# Altium project bch-stmnode_v0.1.PrjPcb (part 2 of 2)

## Sheet analog_mics.SchDoc
size A4; SheetNumber: 7; SheetTotal: 8
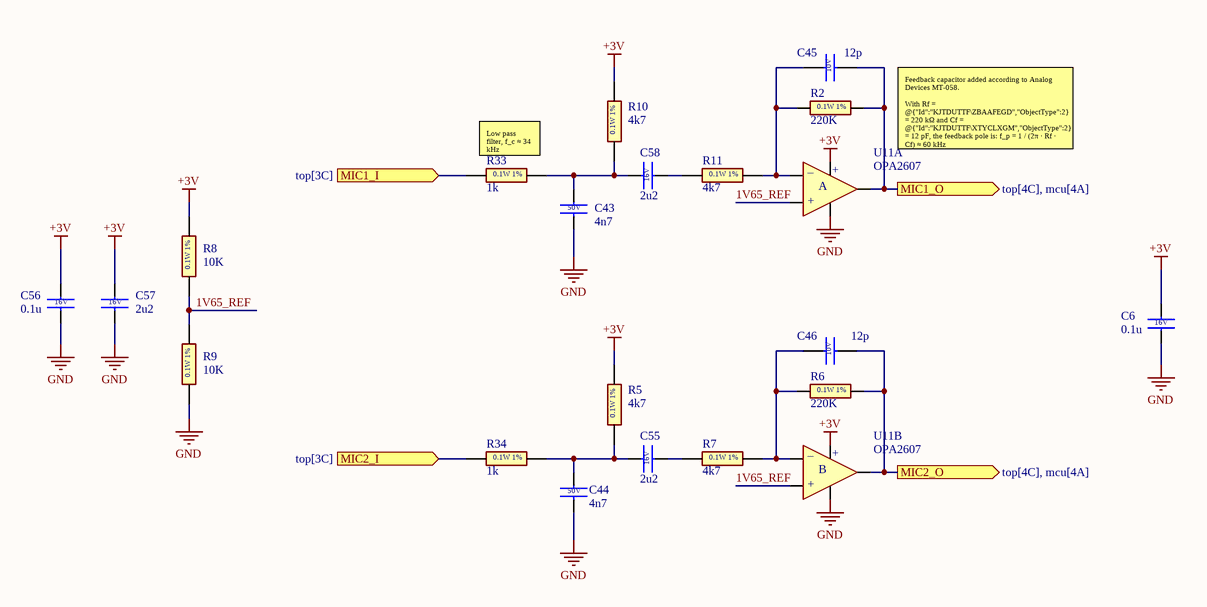
[diagram p6: analog_mics.SchDoc]

### Parts
(Parts that share a designator on the sheet are numbered #1, #2 ... from top to bottom, then left to right.)
C6#2  0.1u  [CAPC1608X95N]
C43  4n7  [C0603]
C44  4n7  [C0603]
C45  12p  [CAPC1608X97N]
C46  12p  [CAPC1608X97N]
C55  2u2  [CAPC1608X90N]
C56  0.1u  [CAPC1608X95N]
C57  2u2  [CAPC1608X90N]
C58  2u2  [CAPC1608X90N]
R2  220K  [RESC1608X55N]
R5  4k7  [RESC1608X50N]
R6  220K  [RESC1608X55N]
R7  4k7  [RESC1608X50N]
R8  10K  [RESC1608X50N]
R9  10K  [RESC1608X50N]
R10  4k7  [RESC1608X50N]
R11  4k7  [RESC1608X50N]
R33#2  1k  [RESC1608X50N]
R34#2  1k  [RESC1608X50N]
U11  OPA2607  [SOIC127P600X175-8N]  (parts A,B of 2)

### Ports
MIC1_I (in, see top[3C]), MIC1_O (out, see top[4C], mcu[4A]), MIC2_I (in, see top[3C]), MIC2_O (out, see top[4C], mcu[4A])

### Nets
+3V: C6#2.1 C56.1 C57.1 R5.2 R8.2 R10.2 U11.8(VS+)
GND: C6#2.2 C43.2 C44.2 C56.2 C57.2 R9.1 U11.4(VS-)
1V65_REF: R8.1 R9.2 U11.3(IN1+) U11.5(IN2+)  [project net 1V65_REF_7]
NetC43_1: C43.1 C58.1 R10.1 R33#2.2
NetC44_1: C44.1 C55.1 R5.1 R34#2.2
NetC45_1: C45.1 R2.1 R11.2 U11.2(IN1-)
NetC45_2: C45.2 R2.2 U11.1(OUT1) ; port MIC1_O
NetC46_1: C46.1 R6.1 R7.2 U11.6(IN2-)
NetC46_2: C46.2 R6.2 U11.7(OUT2) ; port MIC2_O
NetC55_2: C55.2 R7.1
NetC58_2: C58.2 R11.1
NetJ10_3: R33#2.1 ; port MIC1_I
NetJ10_5: R34#2.1 ; port MIC2_I

### Notes on the sheet
- (near R33#2) Low pass filter, f_c ≈ 34 kHz
- Feedback capacitor added according to Analog Devices MT-058.
  With Rf = @{"Id":"KJTDUTTF\ZBAAFEGD","ObjectType":2} = 220 kΩ and Cf = @{"Id":"KJTDUTTF\XTYCLXGM","ObjectType":2} = 12 pF, the feedback pole is: f_p = 1 / (2π · Rf · Cf) ≈ 60 kHz
  This limits high-frequency gain and helps improve stability / RF noise immunity.
- Název výkresu /drawing title/:
- Název souboru /sheet name/:
- Varianta /variant/:
- Organizace /organisation/:
- ČVUT FEL
- Kreslil /drawn by/:
- Datum /date/:
- Podpis /signature/:
- List /sheet/:
- Verze /version/:
- /
- (in symbol ECK+2.2u16V) 16V
- (in symbol ECK+4n750V) 50V
- (in symbol ECK+12p10V) 10V
- (in symbol ECK+100n16V) 16V
- (in symbol ER+1K) 0.1W 1%
- (in symbol ER+4k7) 0.1W 1%
- (in symbol ER+10K) 0.1W 1%
- (in symbol ER+220K) 0.1W 1%
- (in symbol EU+OPA2607IDR, part A) +; –; A
- (in symbol EU+OPA2607IDR, part B) +; –; B

### Library data of the parts
C6#2 C56 = ECK+100n16V: 16V 0.1uF XR7 0603 10%; Manufacturer_Name: KEMET; Manufacturer_Part_Number: C0603C104K4RAC-TU; Datasheet Link: https://connect.kemet.com:7667/gateway/IntelliData-ComponentDocumentation/1.0/download/specsheet/C0603C104K4RACTU; Height: 0.95mm; Mouser Part Number: 80-C0603C104K4RAC; Arrow Part Number: C0603C104K4RAC-TU; Arrow Price/Stock: https://www.arrow.com/en/products/c0603c104k4ractu/kemet-corporation
C43 C44 = ECK+4n750V: 50 VDC, 10 %, X7R; Manufacturer_Name: KEMET; Manufacturer_Part_Number: C0603C472K5RACTU; Datasheet Link: https://content.kemet.com/datasheets/KEM_C1002_X7R_SMD.pdf; Height: 0.87mm; Arrow Part Number: C0603C472K5RACTU; Arrow Price/Stock: https://www.arrow.com/en/products/c0603c472k5ractu/kemet-corporation?region=nac
C45 C46 = ECK+12p10V: Multilayer Ceramic Capacitors MLCC - SMD/SMT 0603 12pF 10volts C0G(N0P) 1%; Manufacturer_Name: Vishay; Manufacturer_Part_Number: VJ0603A120FXQCW1BC; Datasheet Link: https://www.vishay.com/docs/45199/vjcommercialseries.pdf; Height: 0.97mm; Mouser Part Number: 77-VJ0603A120FXQCBC; Mouser Price/Stock: https://www.mouser.com/Search/Refine.aspx?Keyword=77-VJ0603A120FXQCBC; Arrow Part Number: VJ0603A120FXQCW1BC; Arrow Price/Stock: https://www.arrow.com/en/products/vj0603a120fxqcw1bc/vishay
C55 C57 C58 = ECK+2.2u16V: Multilayer Ceramic Capacitors MLCC - SMD/SMT 2.2 uF 16 VDC 10% 0603 X6S; Manufacturer_Name: Murata Electronics; Manufacturer_Part_Number: GRM188C81C225KA12D; Datasheet Link: https://search.murata.co.jp/Ceramy/image/img/A01X/G101/ENG/GRM188C81C225KA12-04A.pdf; Height: 0.9mm; Mouser Part Number: 81-GRM188C81C225KA2D; Mouser Price/Stock: https://www.mouser.co.uk/ProductDetail/Murata-Electronics/GRM188C81C225KA12D?qs=O5cugoO6nwevZQeqg2lgHQ%3D%3D; Arrow Part Number: GRM188C81C225KA12D; Arrow Price/Stock: https://www.arrow.com/en/products/grm188c81c225ka12d/murata-manufacturing?utm_currency=USD&region=nac
R2 R6 = ER+220K: Thick Film Resistors - SMD 1/8 Watt 220Kohms 1%; Manufacturer_Name: Vishay; Manufacturer_Part_Number: CRCW0603220KFKEA; Datasheet Link: https://www.vishay.com/docs/20035/dcrcwe3.pdf; Height: 0.55mm; Mouser Part Number: 71-CRCW0603-220K-E3; Mouser Price/Stock: https://cz.mouser.com/ProductDetail/Vishay/CRCW0603220KFKEA?qs=pVi9qluBdEGy7pbAV1jqkQ%3D%3D
R5 R7 R10 R11 = ER+4k7: Resistor 1%, 0.1W; Manufacturer_Name: Vishay; Manufacturer_Part_Number: CRCW06034K70FKEAHP; Datasheet Link: http://www.farnell.com/datasheets/1885357.pdf; Height: 0.5mm; Mouser Part Number: 71-CRCW06034K70FKEAH; Mouser Price/Stock: https://www.mouser.co.uk/ProductDetail/Vishay-Dale/CRCW06034K70FKEAHP?qs=k2%2FDWSARqgF9tclCHvhGkQ%3D%3D; Arrow Part Number: CRCW06034K70FKEAHP; Arrow Price/Stock: https://www.arrow.com/en/products/crcw06034k70fkeahp/vishay?region=nac
R8 R9 = ER+10K: Resistor 1%, 0.1W; Manufacturer_Name: Vishay; Manufacturer_Part_Number: CRCW060310K0FKEA; Datasheet Link: http://www.vishay.com/docs/20035/dcrcwe3.pdf; Height: 0.5mm; Mouser Part Number: 71-CRCW0603-10K-E3; Mouser Price/Stock: https://www.mouser.co.uk/ProductDetail/Vishay-Dale/CRCW060310K0FKEA?qs=pAO1Z172M84BVnhDjtnsoQ%3D%3D; Arrow Part Number: CRCW060310K0FKEA; Arrow Price/Stock: https://www.arrow.com/en/products/crcw060310k0fkea/vishay?region=europe
R33#2 R34#2 = ER+1K: Resistor 1%, 0.1W; Manufacturer_Name: Vishay; Manufacturer_Part_Number: CRCW06031K00FKEA; Datasheet Link: http://www.vishay.com/docs/20035/dcrcwe3.pdf; Height: 0.5mm; Mouser Part Number: 71-CRCW0603-1.0K-E3; Mouser Price/Stock: https://www.mouser.co.uk/ProductDetail/Vishay-Dale/CRCW06031K00FKEA?qs=CToX950LohJasujQx7GY3g%3D%3D; Arrow Part Number: CRCW06031K00FKEA; Arrow Price/Stock: https://www.arrow.com/en/products/crcw06031k00fkea/vishay?region=europe
U11 = EU+OPA2607IDR: Operational Amplifiers - Op Amps Dual-channel low-po wer precision 50-M; Manufacturer_Name: Texas Instruments; Datasheet Link: https://www.ti.com/lit/ds/symlink/opa2607.pdf; Height: 1.75mm; Manufacturer_Part_Number: OPA2607IDR; Mouser Part Number: 595-OPA2607IDR; Mouser Price/Stock: https://www.mouser.co.uk/ProductDetail/Texas-Instruments/OPA2607IDR?qs=zW32dvEIR3ss%2FpWvIqcTXw%3D%3D; Arrow Part Number: OPA2607IDR; Arrow Price/Stock: https://www.arrow.com/en/products/opa2607idr/texas-instruments

## Sheet project_info.SchDoc
size A4; SheetNumber: 8; SheetTotal: 8
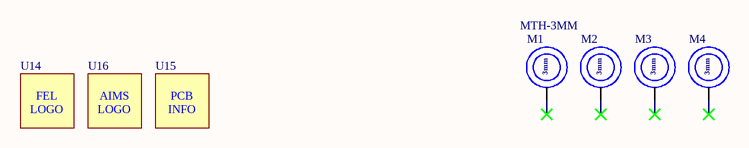
[diagram p7: project_info.SchDoc]

### Parts
M1  MTH-3MM  [MountingHole_3.0mm_NPTH]
M2  MTH-3MM  [MountingHole_3.0mm_NPTH]  (value not drawn)
M3  MTH-3MM  [MountingHole_3.0mm_NPTH]  (value not drawn)
M4  MTH-3MM  [MountingHole_3.0mm_NPTH]  (value not drawn)
U14  SYM+FEL_LOGO  [FEL_LOGO_MED]  (value not drawn)
U15  SYM+PCB_INFO  [PCB_INFO]  (value not drawn)
U16  SYM+AIMS_LOGO  [AIMS_LOGO]  (value not drawn)

### Nets

Not connected (* = marked no-connect by the designer): M1 1*; M2 1*; M3 1*; M4 1*

### Notes on the sheet
- Název výkresu /drawing title/:
- Název souboru /sheet name/:
- Varianta /variant/:
- Organizace /organisation/:
- ČVUT FEL
- Kreslil /drawn by/:
- Datum /date/:
- Podpis /signature/:
- List /sheet/:
- Verze /version/:
- /
- (in symbol EMECH-MTH-3MM) 3mm
- (in symbol SYM+AIMS_LOGO) AIMS / LOGO
- (in symbol SYM+FEL_LOGO) FEL / LOGO
- (in symbol SYM+PCB_INFO) PCB / INFO

### Library data of the parts
M1-M4 = EMECH-MTH-3MM

## Nets that join several sheets
+3V: top (J6.4 J10.1 J11.1), power (9 pins), mcu (35 pins), analog_mics (7 pins)
+3VIMU: power (R58.2 U13.6), imu (10 pins)
+3VLORA: lora (C9.1 C29.1 R12.2 U6.9), power (R57.2 U12.6)
+V_USB: top (J5.A4 J5.A9 U7.5), power (C31.1 C32.1 U8.6)
GND: top (22 pins), gps (18 pins), lora (C9.2 C29.2 U6.1), power (21 pins), mcu (40 pins), imu (13 pins), analog_mics (7 pins)
1PPS: gps (U1.4), mcu (U4.132)
BAT+: top (F1.2), power (8 pins)
BUSY: lora (U6.14), mcu (U4.47)
CLK: lora (R3.1), mcu (U4.41)
DIO1: lora (U6.13), mcu (U4.48)
DIO2: lora (U6.8), mcu (U4.49)
~{GPS_RESET}: gps (R30.1 U1.9), mcu (U4.135)
GPS_RX: gps (U1.3), mcu (U4.140)
GPS_SCL: gps (R36.1), mcu (U4.136)
GPS_SDA: gps (R35.1), mcu (U4.137)
GPS_TX: gps (U1.2), mcu (U4.139)
GPS_WAKE-UP: gps (U1.5), mcu (U4.134)
IMU_CS: mcu (U4.114), imu (U2.12)
IMU_INT1: mcu (U4.110), imu (U2.4)
IMU_INT2: mcu (U4.117), imu (U2.9)
IMU_SCK: mcu (U4.111), imu (R62.2)
IMU_SDI: mcu (U4.113), imu (R64.2)
IMU_SDO: mcu (U4.112), imu (U2.1)
LORA_MISO: lora (U6.16), mcu (U4.42)
LORA_MOSI: lora (R4.1), mcu (U4.43)
LORA_NRST: lora (U6.15), mcu (U4.44)
LORA_NSS: lora (R12.1 U6.19), mcu (U4.40)
LORA_RXEN: lora (U6.6), mcu (U4.45)
LORA_TXEN: lora (U6.7), mcu (U4.46)
MAG_SCL: mcu (U4.11), imu (U3.1)
MAG_SDA: mcu (U4.10), imu (U3.4)
NetC45_2: mcu (U4.34), analog_mics (C45.2 R2.2 U11.1)
NetC46_2: mcu (U4.35), analog_mics (C46.2 R6.2 U11.7)
NetJ10_3: top (J10.3), analog_mics (R33#2.1)
NetJ10_5: top (J10.5), analog_mics (R34#2.1)
NetU4_58: power (U12.3), mcu (U4.58)
NetU4_128: power (U13.3), mcu (U4.128)
PDM_CLK: top (R56.2), mcu (U4.1)
PDM_D1: top (R52.2), mcu (U4.5)
PDM_D2: top (R53.2), mcu (U4.3)
PDM_D3: top (R54.2), mcu (U4.22)
SD_CS: top (R39.2), mcu (U4.13)
SD_DET: top (R43.2), mcu (U4.12)
SD_MISO: top (R42.2), mcu (U4.20)
SD_MOSI: top (R40.2), mcu (U4.21)
SD_SCK: top (R41.2), mcu (U4.19)
USB_D_N: top (U7.4), mcu (U4.103)
USB_D_P: top (U7.6), mcu (U4.104)

## Assembly variants
stmnode: not fitted C35 C36 J2 R1